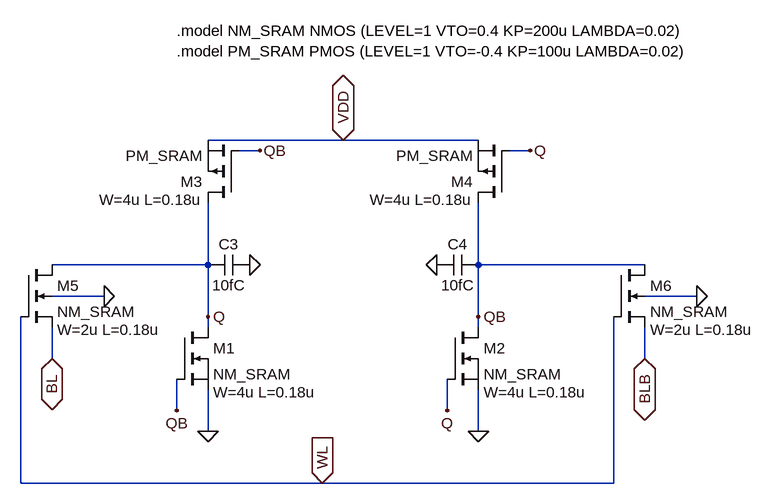
[diagram p0: schematic SRAM_Cell.asc]
SRAM_Cell.asc, the LTspice schematic file:
Version 4.1
SHEET 1 3332 820
WIRE 256 -48 48 -48
WIRE 464 -48 256 -48
WIRE 128 -32 96 -32
WIRE 544 -32 512 -32
WIRE 48 144 48 48
WIRE 48 144 -192 144
WIRE 464 144 464 48
WIRE 720 144 464 144
WIRE -112 192 -192 192
WIRE 800 192 720 192
WIRE 48 224 48 144
WIRE 464 224 464 144
WIRE 48 240 48 224
WIRE 464 240 464 224
WIRE -192 288 -192 240
WIRE 720 288 720 240
WIRE 0 368 0 320
WIRE 416 368 416 320
WIRE 48 400 48 336
WIRE 464 400 464 336
WIRE -240 480 -240 224
WIRE 224 480 -240 480
WIRE 672 480 672 224
WIRE 672 480 224 480
FLAG 48 400 0
FLAG 464 400 0
FLAG 48 224 Q
FLAG 464 224 QB
FLAG 224 480 WL
IOPIN 224 480 In
FLAG -192 288 BL
IOPIN -192 288 BiDir
FLAG 720 288 BLB
IOPIN 720 288 BiDir
FLAG 400 144 0
FLAG 112 144 0
FLAG 544 -32 Q
FLAG 128 -32 QB
FLAG 416 368 Q
FLAG 0 368 QB
FLAG 256 -48 VDD
IOPIN 256 -48 BiDir
FLAG 800 192 0
FLAG -112 192 0
SYMBOL nmos 0 240 R0
WINDOW 39 56 100 Left 2
SYMATTR SpiceLine W=4u L=0.18u
SYMATTR InstName M1
SYMATTR Value NM_SRAM
SYMBOL nmos 416 240 R0
WINDOW 39 56 100 Left 2
SYMATTR SpiceLine W=4u L=0.18u
SYMATTR InstName M2
SYMATTR Value NM_SRAM
SYMBOL pmos 96 48 R180
WINDOW 39 56 4 Left 2
SYMATTR SpiceLine W=4u L=0.18u
SYMATTR InstName M3
SYMATTR Value PM_SRAM
SYMBOL pmos 512 48 R180
WINDOW 39 56 4 Left 2
SYMATTR SpiceLine W=4u L=0.18u
SYMATTR InstName M4
SYMATTR Value PM_SRAM
SYMBOL nmos4 -240 144 R0
WINDOW 39 56 100 Left 2
SYMATTR SpiceLine W=2u L=0.18u
SYMATTR InstName M5
SYMATTR Value NM_SRAM
SYMBOL nmos4 672 144 R0
WINDOW 39 56 100 Left 2
SYMATTR SpiceLine W=2u L=0.18u
SYMATTR InstName M6
SYMATTR Value NM_SRAM
SYMBOL cap 112 128 R90
WINDOW 0 0 32 VBottom 2
WINDOW 3 32 32 VTop 2
SYMATTR InstName C3
SYMATTR Value 10fC
SYMBOL cap 464 128 R90
WINDOW 0 0 32 VBottom 2
WINDOW 3 32 32 VTop 2
SYMATTR InstName C4
SYMATTR Value 10fC
TEXT 0 -216 Left 2 !.model NM_SRAM NMOS (LEVEL=1 VTO=0.4 KP=200u LAMBDA=0.02)\n.model PM_SRAM PMOS (LEVEL=1 VTO=-0.4 KP=100u LAMBDA=0.02)

The netlist it stands for:
* SRAM_Cell.asc
M1 Q QB 0 0 NM_SRAM W=4u L=0.18u
M2 QB Q 0 0 NM_SRAM W=4u L=0.18u
M3 Q QB VDD VDD PM_SRAM W=4u L=0.18u
M4 QB Q VDD VDD PM_SRAM W=4u L=0.18u
M5 Q WL BL 0 NM_SRAM W=2u L=0.18u
M6 QB WL BLB 0 NM_SRAM W=2u L=0.18u
C3 0 Q 10fC
C4 QB 0 10fC
.model NMOS NMOS
.model PMOS PMOS
.lib standard.mos
.model NM_SRAM NMOS (LEVEL=1 VTO=0.4 KP=200u LAMBDA=0.02)
.model PM_SRAM PMOS (LEVEL=1 VTO=-0.4 KP=100u LAMBDA=0.02)
.backanno
.end